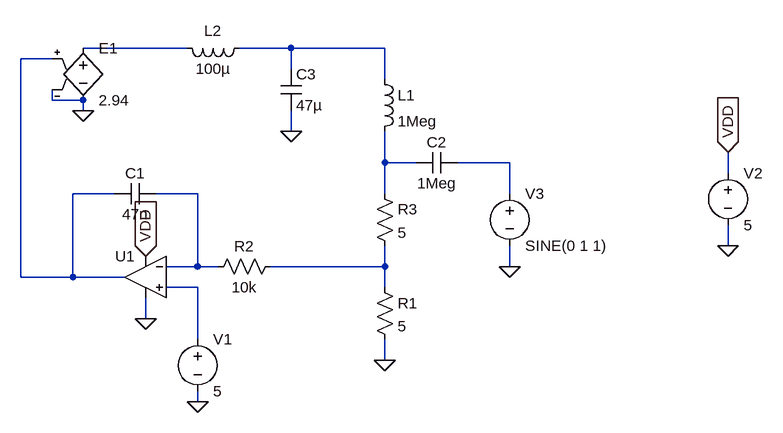
[diagram p0: schematic prelab3_stabilityanalysis.asc]
prelab3_stabilityanalysis.asc, the LTspice schematic file:
Version 4
SHEET 1 900 680
WIRE -16 -128 -176 -128
WIRE 144 -128 64 -128
WIRE 288 -128 144 -128
WIRE -224 -112 -272 -112
WIRE 144 -96 144 -128
WIRE 288 -80 288 -128
WIRE -224 -48 -224 -64
WIRE -176 -48 -224 -48
WIRE -176 -32 -176 -48
WIRE 144 0 144 -32
WIRE 288 48 288 0
WIRE 336 48 288 48
WIRE 480 48 400 48
WIRE 816 64 816 32
WIRE -128 96 -192 96
WIRE 0 96 -64 96
WIRE 288 96 288 48
WIRE 480 96 480 48
WIRE 816 176 816 144
WIRE 0 208 0 96
WIRE 0 208 -48 208
WIRE 32 208 0 208
WIRE 288 208 288 176
WIRE 288 208 112 208
WIRE 480 208 480 176
WIRE -272 224 -272 -112
WIRE -192 224 -192 96
WIRE -192 224 -272 224
WIRE -112 224 -192 224
WIRE 0 240 -48 240
WIRE 288 240 288 208
WIRE -80 288 -80 256
WIRE 0 320 0 240
WIRE 288 352 288 320
WIRE 0 416 0 400
FLAG 288 352 0
FLAG 0 416 0
FLAG -80 288 0
FLAG -80 192 VDD
IOPIN -80 192 In
FLAG 816 32 VDD
IOPIN 816 32 In
FLAG 816 176 0
FLAG 480 208 0
FLAG 144 0 0
FLAG -176 -32 0
SYMBOL res 272 224 R0
SYMATTR InstName R1
SYMATTR Value 5
SYMBOL OpAmps\\UniversalOpAmp1 -80 224 M0
SYMATTR InstName U1
SYMBOL res 128 192 R90
WINDOW 0 0 56 VBottom 2
WINDOW 3 32 56 VTop 2
SYMATTR InstName R2
SYMATTR Value 10k
SYMBOL cap -64 80 R90
WINDOW 0 0 32 VBottom 2
WINDOW 3 32 32 VTop 2
SYMATTR InstName C1
SYMATTR Value 47n
SYMBOL voltage 0 304 R0
WINDOW 123 0 0 Left 0
WINDOW 39 0 0 Left 0
SYMATTR InstName V1
SYMATTR Value 5
SYMBOL voltage 816 48 R0
WINDOW 123 0 0 Left 0
WINDOW 39 0 0 Left 0
SYMATTR InstName V2
SYMATTR Value 5
SYMBOL res 272 80 R0
SYMATTR InstName R3
SYMATTR Value 5
SYMBOL cap 400 32 R90
WINDOW 0 0 32 VBottom 2
WINDOW 3 32 32 VTop 2
SYMATTR InstName C2
SYMATTR Value 1Meg
SYMBOL ind 272 -96 R0
SYMATTR InstName L1
SYMATTR Value 1Meg
SYMBOL voltage 480 80 R0
WINDOW 123 0 0 Left 0
WINDOW 39 0 0 Left 0
SYMATTR InstName V3
SYMATTR Value SINE(0 1 1)
SYMBOL ind 80 -144 R90
WINDOW 0 5 56 VBottom 2
WINDOW 3 32 56 VTop 2
SYMATTR InstName L2
SYMATTR Value 100µ
SYMBOL cap 128 -96 R0
SYMATTR InstName C3
SYMATTR Value 47µ
SYMBOL e -176 -144 R0
SYMATTR InstName E1
SYMATTR Value 2.94

The netlist it stands for:
* prelab3_stabilityanalysis.asc
R1 N007 0 5
XU1 N008 N006 VDD 0 N003 level1 Avol=1Meg GBW=10Meg Vos=0 En=0 Enk=0 In=0 Ink=0 Rin=500Meg  ; pins In+ In- V+ V- OUT
R2 N007 N006 10k
C1 N006 N003 47n
V1 N008 0 5
V2 VDD 0 5
R3 N004 N007 5
C2 N005 N004 1Meg
L1 N002 N004 1Meg
V3 N005 0 SINE(0 1 1)
L2 N002 N001 100µ
C3 N002 0 47µ
E1 N001 0 N003 0 2.94
.lib UniversalOpAmp1.lib
.backanno
.end